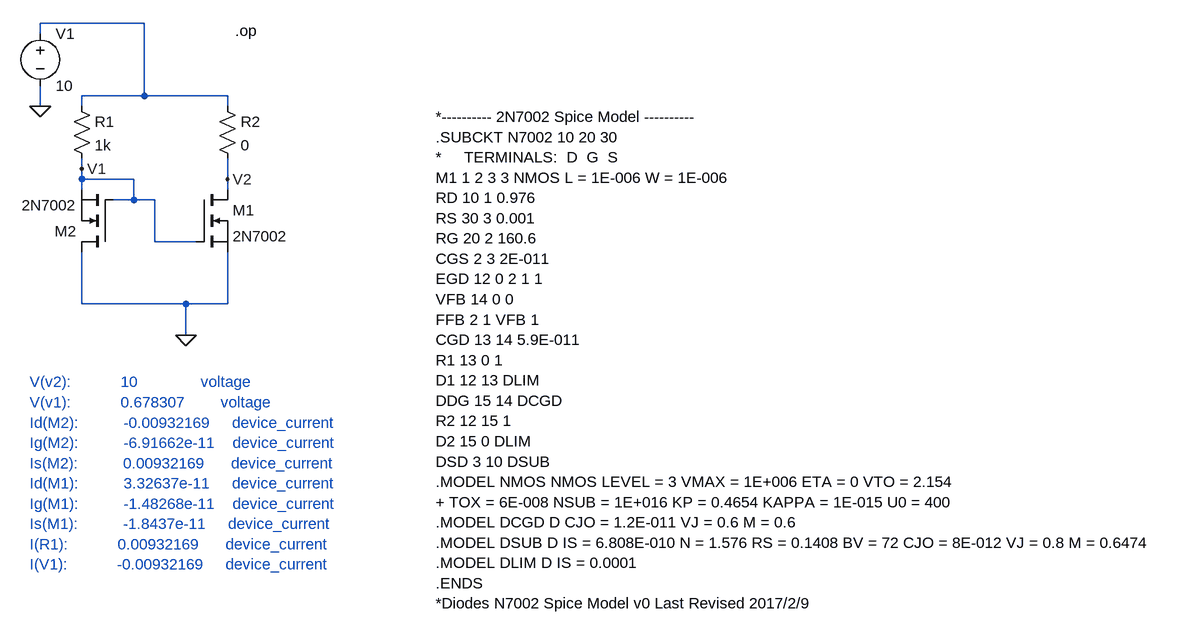
[diagram p0: schematic parte 2_espelho.asc]
parte 2_espelho.asc, the LTspice schematic file:
Version 4
SHEET 1 1728 756
WIRE 96 -192 -64 -192
WIRE -64 -176 -64 -192
WIRE 96 -80 96 -192
WIRE 96 -80 0 -80
WIRE 224 -80 96 -80
WIRE -64 -64 -64 -96
WIRE 0 -64 0 -80
WIRE 224 -64 224 -80
WIRE 0 32 0 16
WIRE 0 48 0 32
WIRE 80 48 0 48
WIRE 224 48 224 16
WIRE 0 64 0 48
WIRE 224 64 224 48
WIRE 80 80 80 48
WIRE 80 80 48 80
WIRE 112 80 80 80
WIRE 112 144 112 80
WIRE 176 144 112 144
WIRE 0 240 0 160
WIRE 160 240 0 240
WIRE 224 240 224 160
WIRE 224 240 160 240
WIRE 160 288 160 240
FLAG 160 288 0
FLAG -64 -64 0
FLAG 224 48 V2
FLAG 0 32 V1
SYMBOL res 208 -80 R0
SYMATTR InstName R2
SYMATTR Value 0
SYMBOL res -16 -80 R0
SYMATTR InstName R1
SYMATTR Value 1k
SYMBOL nmos 176 64 R0
SYMATTR InstName M1
SYMATTR Value 2N7002
SYMBOL nmos 48 160 R180
SYMATTR InstName M2
SYMATTR Value 2N7002
SYMBOL voltage -64 -192 R0
WINDOW 123 0 0 Left 0
WINDOW 39 0 0 Left 0
SYMATTR InstName V1
SYMATTR Value 10
TEXT 544 -48 Left 2 !*---------- 2N7002 Spice Model ----------\n.SUBCKT N7002 10 20 30 \n*     TERMINALS:  D  G  S\nM1 1 2 3 3 NMOS L = 1E-006 W = 1E-006 \nRD 10 1 0.976 \nRS 30 3 0.001 \nRG 20 2 160.6 \nCGS 2 3 2E-011 \nEGD 12 0 2 1 1 \nVFB 14 0 0 \nFFB 2 1 VFB 1 \nCGD 13 14 5.9E-011 \nR1 13 0 1 \nD1 12 13 DLIM \nDDG 15 14 DCGD \nR2 12 15 1 \nD2 15 0 DLIM \nDSD 3 10 DSUB \n.MODEL NMOS NMOS LEVEL = 3 VMAX = 1E+006 ETA = 0 VTO = 2.154 \n+ TOX = 6E-008 NSUB = 1E+016 KP = 0.4654 KAPPA = 1E-015 U0 = 400 \n.MODEL DCGD D CJO = 1.2E-011 VJ = 0.6 M = 0.6 \n.MODEL DSUB D IS = 6.808E-010 N = 1.576 RS = 0.1408 BV = 72 CJO = 8E-012 VJ = 0.8 M = 0.6474 \n.MODEL DLIM D IS = 0.0001 \n.ENDS\n*Diodes N7002 Spice Model v0 Last Revised 2017/2/9
TEXT 236 -180 Left 2 !.op
TEXT -80 360 Left 2 ;V(v2):           10              voltage\nV(v1):           0.678307        voltage\nId(M2):          -0.00932169     device_current\nIg(M2):          -6.91662e-11    device_current\nIs(M2):          0.00932169      device_current\nId(M1):          3.32637e-11     device_current\nIg(M1):          -1.48268e-11    device_current\nIs(M1):          -1.8437e-11     device_current\nI(R1):           0.00932169      device_current\nI(V1):           -0.00932169     device_current

The netlist it stands for:
* parte 2_espelho.asc
R2 N001 V2 0
R1 N001 V1 1k
M1 V2 V1 0 0 2N7002
M2 0 V1 V1 V1 2N7002
V1 N001 0 10
.model NMOS NMOS
.model PMOS PMOS
.lib standard.mos
*---------- 2N7002 Spice Model ----------
.SUBCKT N7002 10 20 30
*     TERMINALS:  D  G  S
M1 1 2 3 3 NMOS L = 1E-006 W = 1E-006
RD 10 1 0.976
RS 30 3 0.001
RG 20 2 160.6
CGS 2 3 2E-011
EGD 12 0 2 1 1
VFB 14 0 0
FFB 2 1 VFB 1
CGD 13 14 5.9E-011
R1 13 0 1
D1 12 13 DLIM
DDG 15 14 DCGD
R2 12 15 1
D2 15 0 DLIM
DSD 3 10 DSUB
.MODEL NMOS NMOS LEVEL = 3 VMAX = 1E+006 ETA = 0 VTO = 2.154
+ TOX = 6E-008 NSUB = 1E+016 KP = 0.4654 KAPPA = 1E-015 U0 = 400
.MODEL DCGD D CJO = 1.2E-011 VJ = 0.6 M = 0.6
.MODEL DSUB D IS = 6.808E-010 N = 1.576 RS = 0.1408 BV = 72 CJO = 8E-012 VJ = 0.8 M = 0.6474
.MODEL DLIM D IS = 0.0001
.ENDS
*Diodes N7002 Spice Model v0 Last Revised 2017/2/9
.op
* V(v2):           10              voltage
* V(v1):           0.678307        voltage
* Id(M2):          -0.00932169     device_current
* Ig(M2):          -6.91662e-11    device_current
* Is(M2):          0.00932169      device_current
* Id(M1):          3.32637e-11     device_current
* Ig(M1):          -1.48268e-11    device_current
* Is(M1):          -1.8437e-11     device_current
* I(R1):           0.00932169      device_current
* I(V1):           -0.00932169     device_current
.backanno
.end